# EAGLE design DisplayBank (EAGLE 7.1.0)
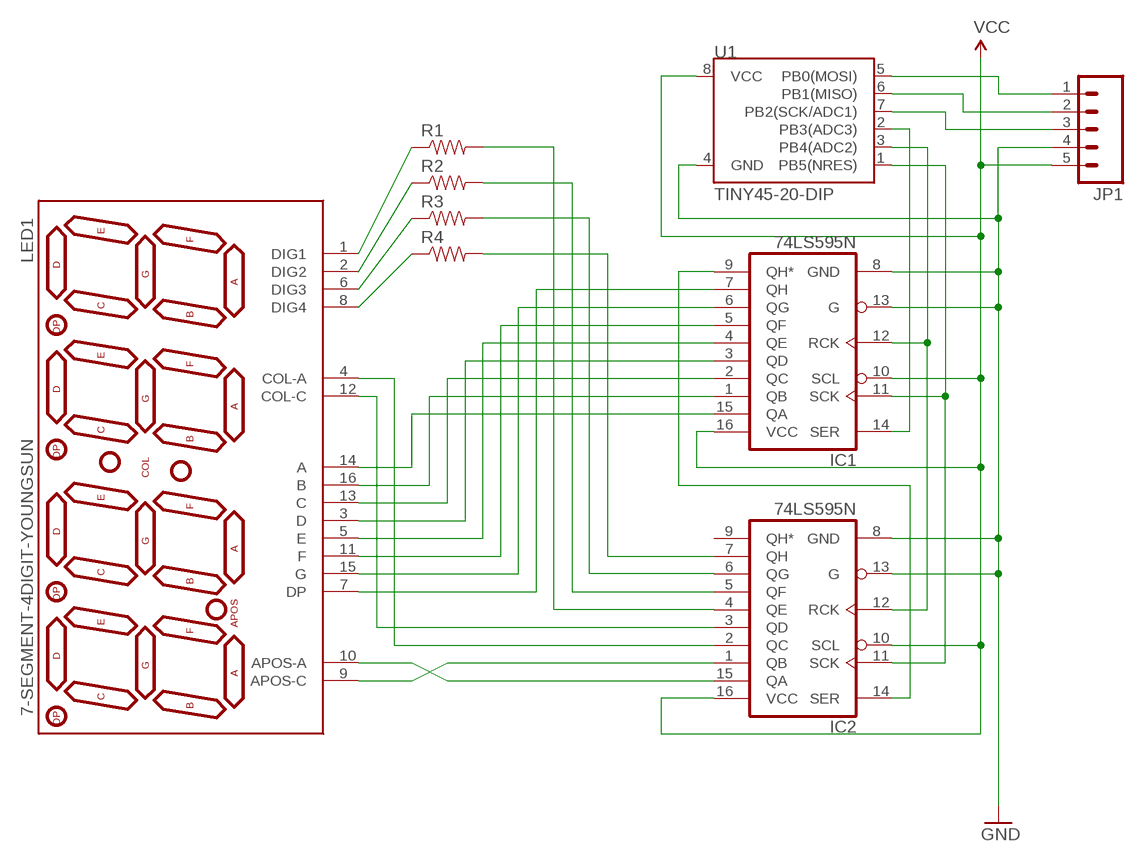
[diagram p0: schematic, sheet 1]

## Parts
IC1  74LS595N  [DIL16]
IC2  74LS595N  [DIL16]
JP1  M05NO_SILK  [1X05_NO_SILK]
LED1  7-SEGMENT-4DIGIT-YOUNGSUN  [7-SEGMENT-4DIGIT-YOUNGSUN]
R1  RESISTORPTH-1/4W  [AXIAL-0.4]
R2  RESISTORPTH-1/4W  [AXIAL-0.4]
R3  RESISTORPTH-1/4W  [AXIAL-0.4]
R4  RESISTORPTH-1/4W  [AXIAL-0.4]
U1  TINY45-20-DIP  ATTINY45TINY45-20-DIP  [DIP08]

## Nets
GND: IC1.8(GND) IC1.13(G) IC2.8(GND) IC2.13(G) JP1.4 U1.4(GND)
N$1: IC1.2(QC) LED1.13(C)
N$2: IC1.3(QD) LED1.3(D)
N$3: IC1.15(QA) LED1.14(A)
N$4: IC1.1(QB) LED1.16(B)
N$5: IC1.4(QE) LED1.5(E)
N$6: IC1.5(QF) LED1.11(F)
N$7: IC1.6(QG) LED1.15(G)
N$8: IC1.7(QH) LED1.7(DP)
N$9: IC1.9(QH*) IC2.14(SER)
N$10: LED1.8(DIG4) R4.P$1
N$11: LED1.6(DIG3) R3.P$1
N$12: LED1.2(DIG2) R2.P$1
N$13: LED1.1(DIG1) R1.P$1
N$14: IC2.15(QA) LED1.10(APOS-A)
N$15: IC2.1(QB) LED1.9(APOS-C)
N$16: IC2.2(QC) LED1.4(COL-A)
N$17: IC2.3(QD) LED1.12(COL-C)
N$18: IC2.4(QE) R1.P$2
N$19: IC2.5(QF) R2.P$2
N$20: IC2.6(QG) R3.P$2
N$21: IC2.7(QH) R4.P$2
N$22: IC1.12(RCK) IC2.12(RCK) U1.3(PB4(ADC2))
N$23: IC1.11(SCK) IC2.11(SCK) U1.1(PB5(NRES))
N$24: JP1.1 U1.5(PB0(MOSI))
N$25: JP1.2 U1.6(PB1(MISO))
N$26: JP1.3 U1.7(PB2(SCK/ADC1))
N$27: IC1.14(SER) U1.2(PB3(ADC3))
VCC: IC1.10(SCL) IC1.16(VCC) IC2.10(SCL) IC2.16(VCC) JP1.5 U1.8(VCC)
Unconnected: IC2.9(QH*)

## Library data of the parts
IC1 IC2 = SparkFun-DigitalIC:74*595: 8-bit SHIFT REGISTER, output latch
JP1 = SparkFun-Connectors:M05: Header 5 Standard 5-pin 0.1" header. Use with straight break away headers (SKU : PRT-00116), right angle break away headers (PRT-00553), swiss pins (PRT-00743), machine pins (PRT-00117), and female headers (PRT-00115). Molex polarized connector foot print use with SKU : PRT-08230 with associated crimp pins and housings.
LED1 = SparkFun-Displays:7-SEGMENT-4DIGIT-YOUNGSUN: This is a part for the 4-Digit 7-segment LEDs from Young Sun. Different from the Digikey LEDs, all 16 pins are used. The LONGPADS Variant is used for a test jig, but you may like it because there is more pad to solder to. If you are concerned about routing space, the standard works just fine though.
R1-R4 = SparkFun-Passives:RESISTOR: Resistor Basic schematic elements and footprints for 0603, 1206, and PTH resistors.
U1 = SparkFun-DigitalIC:ATTINY45: Atmel 8-pin 2/4/8kB flash uC; PROD_ID: IC-09439

## Board
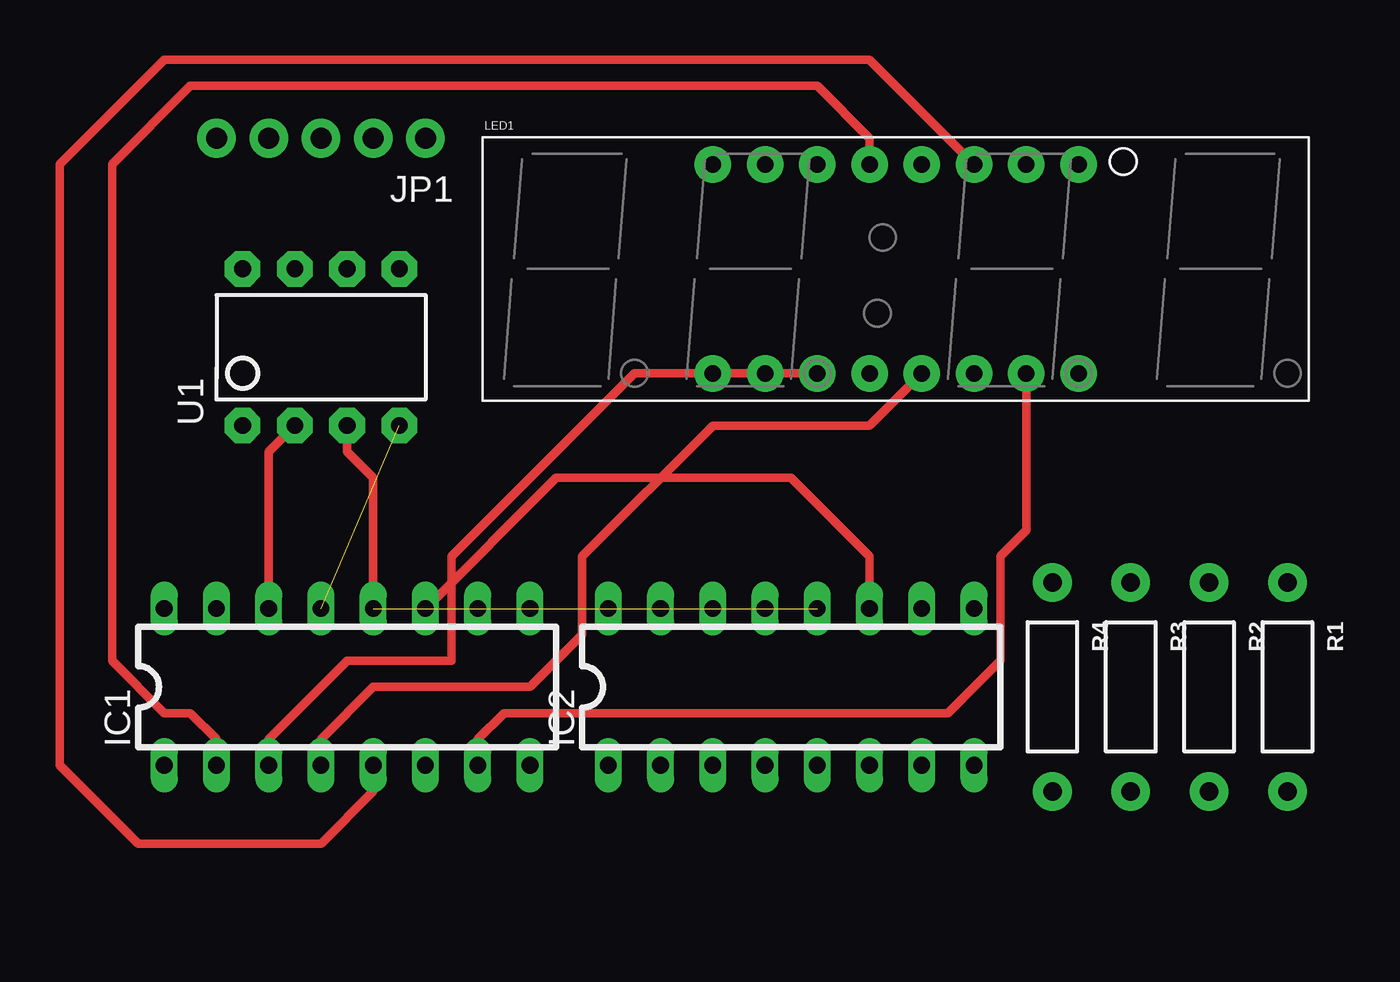
[diagram p1: board, top side]
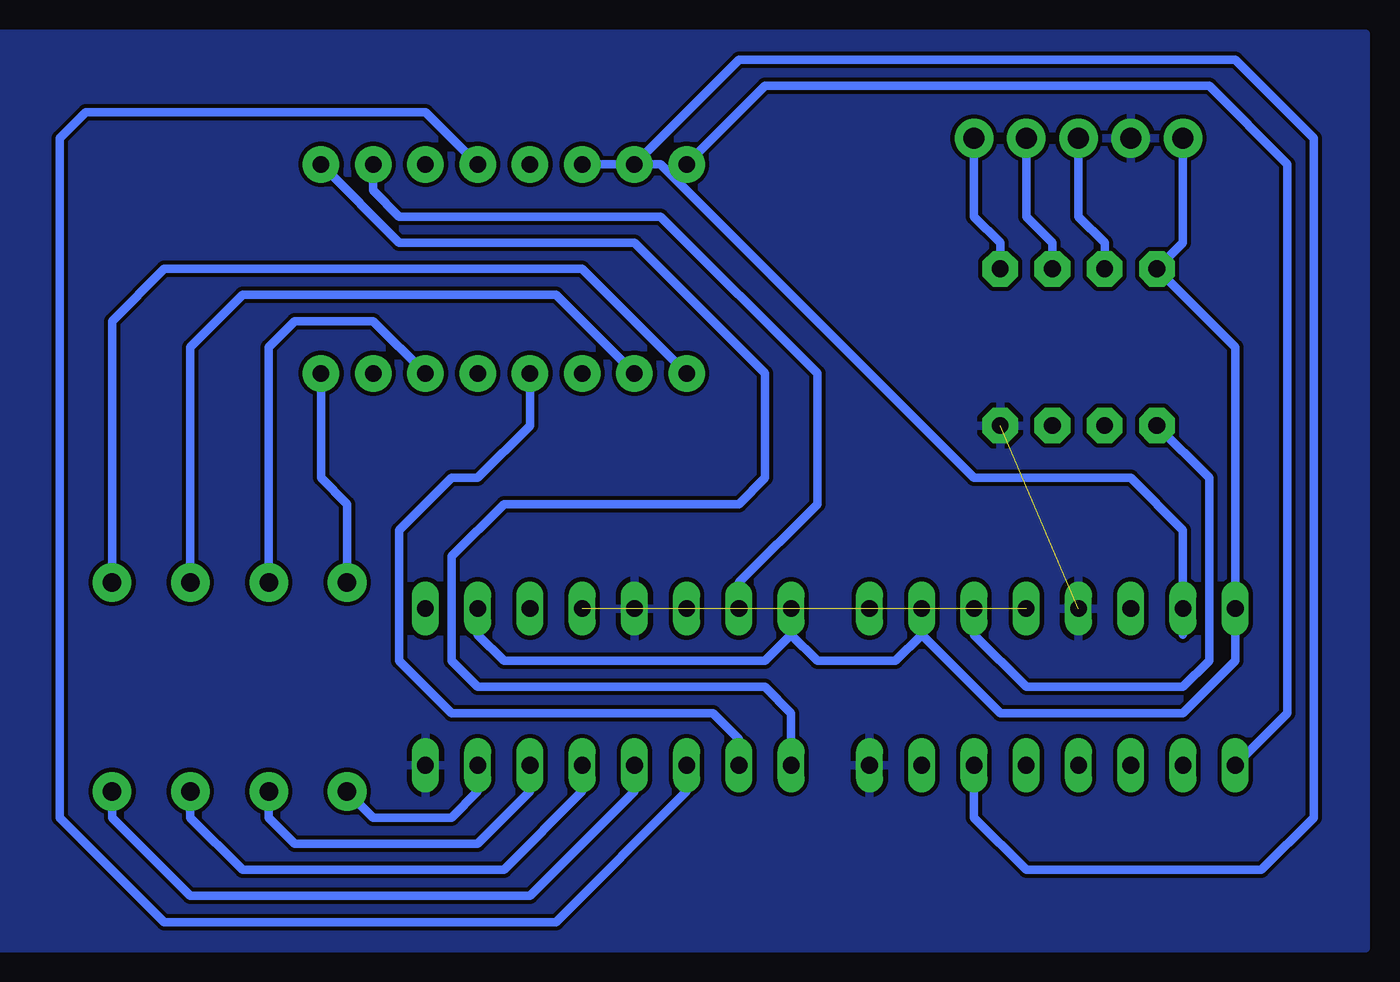
[diagram p2: board, bottom side, seen from below]

No outline drawn. Coordinates in mm, seen from the top.
Copper layers (1*16): Top 0.035mm / dielectric 1.5mm / Bottom 0.035mm
Design rules "default": minimum track width 10mil, minimum drill 24mil, track to track 8mil, track to pad 8mil, pad to pad 8mil, via to via 8mil, smd to smd 8mil, copper to edge 40mil, drill to drill 8mil, minimum pad ring 10mil, minimum via ring 8mil, stop-mask expansion 4mil, vias tented up to drill 0mil, thermal gap 10mil

### Footprints (pad centres in the part's own frame; a part is rotated, then mirrored left to right if it is on the bottom)
DIL16 = drill 0.813 long: 1 -8.89,-3.81; 2 -6.35,-3.81; 3 -3.81,-3.81; 4 -1.27,-3.81; 5 1.27,-3.81; 6 3.81,-3.81; 7 6.35,-3.81; 8 8.89,-3.81; 9 8.89,3.81; 10 6.35,3.81; 11 3.81,3.81; 12 1.27,3.81; 13 -1.27,3.81; 14 -3.81,3.81; 15 -6.35,3.81; 16 -8.89,3.81
1X05_NO_SILK = drill 1.016 pad 1.88: 1 0,0; 2 2.54,0; 3 5.08,0; 4 7.62,0; 5 10.16,0
7-SEGMENT-4DIGIT-YOUNGSUN = drill 0.8 pad 1.778: 1 -8.89,-5.08; 2 -6.35,-5.08; 3 -3.81,-5.08; 4 -1.27,-5.08; 5 1.27,-5.08; 6 3.81,-5.08; 7 6.35,-5.08; 8 8.89,-5.08; 9 8.89,5.08; 10 6.35,5.08; 11 3.81,5.08; 12 1.27,5.08; 13 -1.27,5.08; 14 -3.81,5.08; 15 -6.35,5.08; 16 -8.89,5.08
AXIAL-0.4 = drill 0.9 pad 1.88: P$1 -5.08,0; P$2 5.08,0
DIP08 = drill 0.813 pad 1.727 octagon: 1 -3.81,-3.81; 2 -1.27,-3.81; 3 1.27,-3.81; 4 3.81,-3.81; 5 3.81,3.81; 6 1.27,3.81; 7 -1.27,3.81; 8 -3.81,3.81

### Placement (x,y rotation side)
IC1  35.56,22.86 0 top
IC2  57.15,22.86 0 top
JP1  39.37,49.53 180 top
LED1  62.23,43.18 0 top
R1  81.28,22.86 270 top
R2  77.47,22.86 270 top
R3  73.66,22.86 270 top
R4  69.85,22.86 270 top
U1  34.29,39.37 0 top

### Tracks (layer width: path | path; a pad name or v marks a point on that pad's centre or on a via)
GND  (1 unrouted)
  pour Bottom: 20.32,54.61 90.17,54.61 90.17,10.16 20.32,10.16
N$1
  Top 0.406: IC1.2 29.21,20.32 27.94,21.59 26.67,21.59 24.13,24.13 24.13,48.26 27.94,52.07 58.42,52.07 60.96,49.53 LED1.13
N$2
  Top 0.406: LED1.3 49.53,38.1 40.64,29.21 40.64,24.13 35.56,24.13 31.75,20.32 IC1.3
N$3
  Bottom 0.406: 29.21,25.4 IC1.15 29.21,30.48 31.75,33.02 39.37,33.02 54.61,48.26 LED1.14
N$4
  Bottom 0.406: LED1.16 49.53,52.07 27.94,52.07 24.13,48.26 24.13,21.59 IC1.1
N$5
  Top 0.406: IC1.4 34.29,20.32 36.83,22.86 44.45,22.86 46.99,25.4 46.99,29.21 53.34,35.56 60.96,35.56 LED1.5
N$6
  Top 0.406: LED1.11 60.96,53.34 26.67,53.34 21.59,48.26 21.59,19.05 25.4,15.24 34.29,15.24 36.83,17.78 IC1.5
N$7
  Bottom 0.406: LED1.15 50.8,53.34 26.67,53.34 22.86,49.53 22.86,16.51 25.4,13.97 36.83,13.97 39.37,16.51 IC1.6
N$8
  Top 0.406: IC1.7 41.91,20.32 43.18,21.59 64.77,21.59 67.31,24.13 67.31,29.21 68.58,30.48 LED1.7
N$9  (1 unrouted)
N$10
  Bottom 0.406: LED1.8 71.12,33.02 69.85,31.75 R4.P$1
N$11
  Bottom 0.406: R3.P$1 73.66,39.37 72.39,40.64 68.58,40.64 LED1.6
N$12
  Bottom 0.406: R2.P$1 77.47,39.37 74.93,41.91 59.69,41.91 LED1.2
N$13
  Bottom 0.406: R1.P$1 81.28,40.64 78.74,43.18 58.42,43.18 LED1.1
N$14
  Bottom 0.406: LED1.10 68.58,46.99 67.31,45.72 54.61,45.72 46.99,38.1 46.99,31.75 50.8,27.94 IC2.15
N$15
  Bottom 0.406: IC2.1 48.26,21.59 49.53,22.86 63.5,22.86 64.77,24.13 64.77,29.21 62.23,31.75 50.8,31.75 49.53,33.02 49.53,38.1 55.88,44.45 67.31,44.45 LED1.9
N$16
  Bottom 0.406: IC2.2 50.8,20.32 52.07,21.59 64.77,21.59 67.31,24.13 67.31,30.48 64.77,33.02 63.5,33.02 60.96,35.56 LED1.4
N$17
  Bottom 0.406: IC2.3 53.34,17.78 59.69,11.43 78.74,11.43 83.82,16.51 83.82,49.53 82.55,50.8 66.04,50.8 LED1.12
N$18
  Bottom 0.406: IC2.4 55.88,17.78 60.96,12.7 77.47,12.7 81.28,16.51 R1.P$2
N$19
  Bottom 0.406: R2.P$2 77.47,16.51 74.93,13.97 62.23,13.97 58.42,17.78 IC2.5
N$20
  Bottom 0.406: IC2.6 60.96,17.78 63.5,15.24 72.39,15.24 73.66,16.51 R3.P$2
N$21
  Bottom 0.406: IC2.7 63.5,17.78 64.77,16.51 68.58,16.51 R4.P$2
N$22  (1 unrouted)
  Top 0.406: U1.3 35.56,34.29 36.83,33.02 IC1.12
N$23
  Top 0.406: IC2.11 60.96,29.21 57.15,33.02 45.72,33.02 IC1.11
  Bottom 0.406: U1.1 27.94,33.02 27.94,24.13 29.21,22.86 36.83,22.86 39.37,25.4 IC1.11
N$24
  Bottom 0.406: U1.5 38.1,44.45 39.37,45.72 JP1.1
N$25
  Bottom 0.406: U1.6 35.56,44.45 36.83,45.72 JP1.2
N$26
  Bottom 0.406: U1.7 33.02,44.45 34.29,45.72 JP1.3
N$27
  Top 0.406: IC1.14 31.75,34.29 U1.2
VCC
  Bottom 0.406: JP1.5 29.21,44.45 U1.8 26.67,39.37 IC1.16 26.67,24.13 29.21,21.59 38.1,21.59 41.91,25.4 | 41.91,25.4 IC1.10 | 48.26,25.4 46.99,24.13 43.18,24.13 41.91,25.4 | IC2.16 48.26,25.4 | 48.26,25.4 49.53,24.13 62.23,24.13 63.5,25.4 IC2.10